# Altium schematic sheet XTXBoard(2CPU).SchDoc
size C; DocumentNumber: 6; SheetNumber: 6; SheetTotal: 8
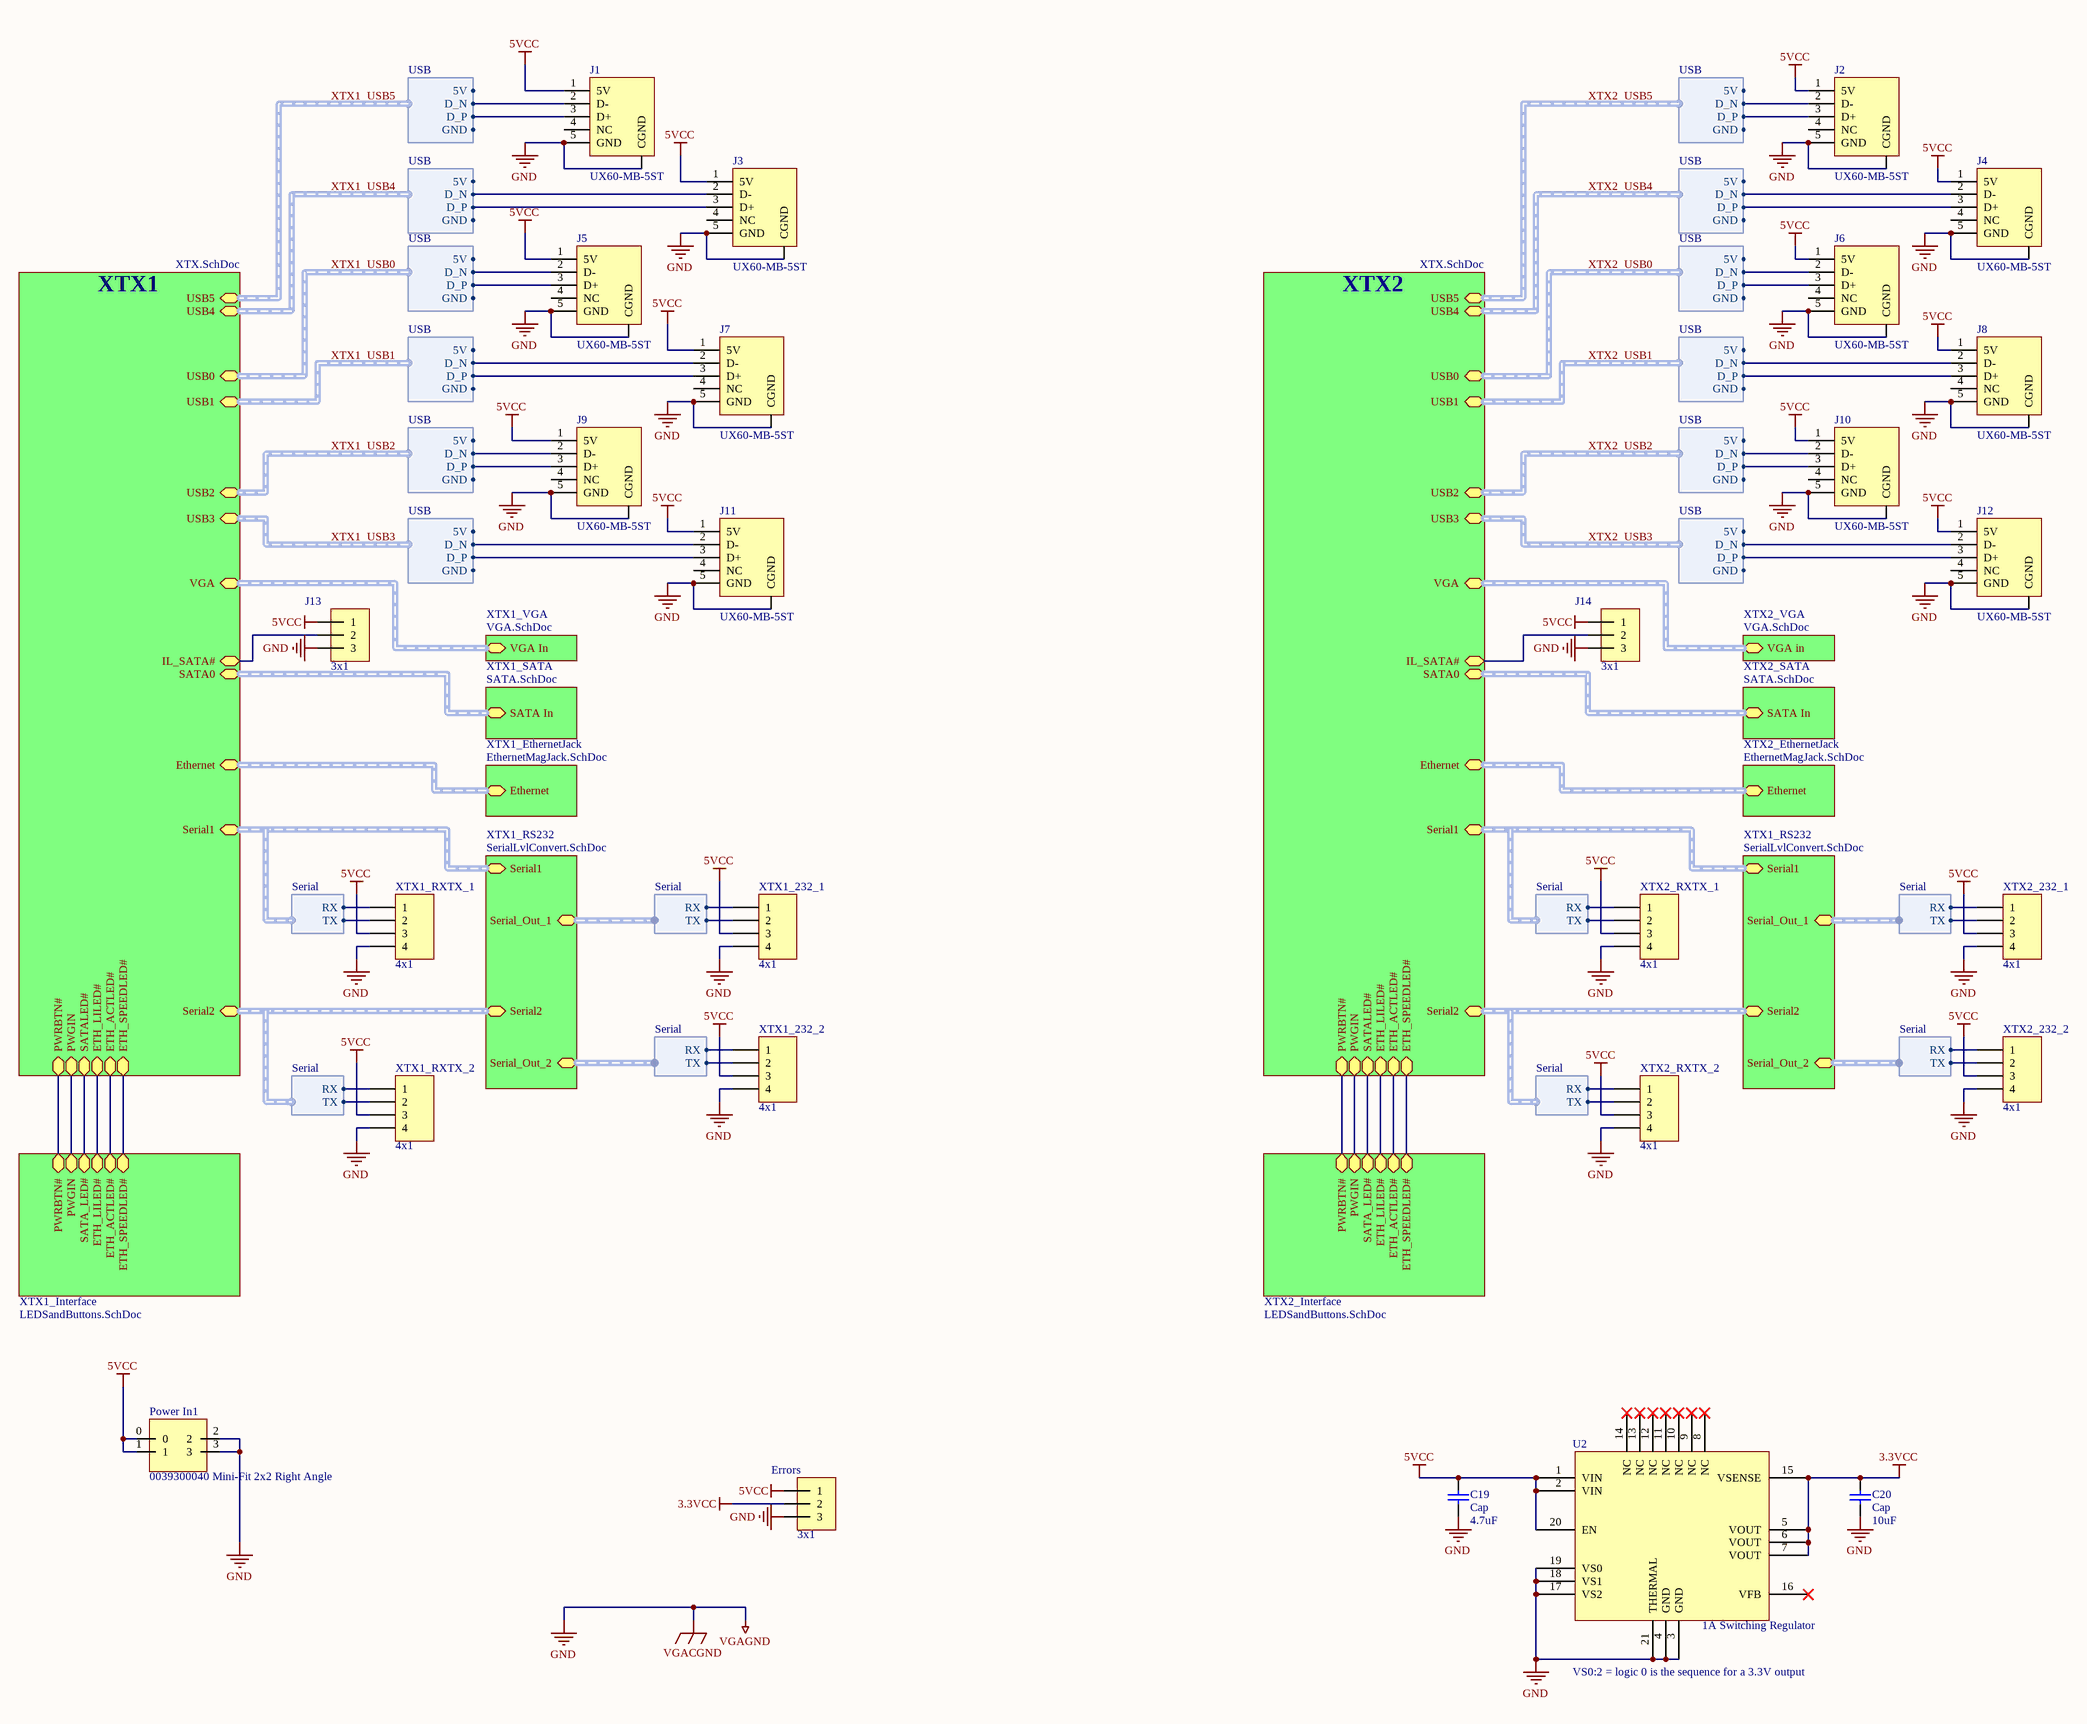
[diagram p0: XTXBoard(2CPU).SchDoc]

## Parts
C19  Cap  value 4.7uF  [0805 (2012) Capacitor]
C20  Cap  value 10uF  [1210 (3225) Capacitor]
Errors  3x1  [Male 3x1]
J1  UX60-MB-5ST  [UX60-MB-5ST]
J2  UX60-MB-5ST  [UX60-MB-5ST]
J3  UX60-MB-5ST  [UX60-MB-5ST]
J4  UX60-MB-5ST  [UX60-MB-5ST]
J5  UX60-MB-5ST  [UX60-MB-5ST]
J6  UX60-MB-5ST  [UX60-MB-5ST]
J7  UX60-MB-5ST  [UX60-MB-5ST]
J8  UX60-MB-5ST  [UX60-MB-5ST]
J9  UX60-MB-5ST  [UX60-MB-5ST]
J10  UX60-MB-5ST  [UX60-MB-5ST]
J11  UX60-MB-5ST  [UX60-MB-5ST]
J12  UX60-MB-5ST  [UX60-MB-5ST]
J13  3x1  [Male 3x1]
J14  3x1  [Male 3x1]
Power_In1  0039300040 Mini-Fit 2x2 Right Angle  [0039300040 MINI-FIT JR 4-Pos Right Angle]
U2  1A Switching Regulator  [QFN65P400X500X80-20N]
XTX1_232_1  4x1  [Male 4x1]
XTX1_232_2  4x1  [Male 4x1]
XTX1_RXTX_1  4x1  [Male 4x1]
XTX1_RXTX_2  4x1  [Male 4x1]
XTX2_232_1  4x1  [Male 4x1]
XTX2_232_2  4x1  [Male 4x1]
XTX2_RXTX_1  4x1  [Male 4x1]
XTX2_RXTX_2  4x1  [Male 4x1]

## Sub-sheets
XTX1 = XTX.SchDoc: ETH_LILED#, ETH_ACTLED#, ETH_SPEEDLED#, Ethernet (harness Ethernet), SATA0 (harness SATA), VGA (harness VGA), USB0 (harness USB), USB2 (harness USB), USB3 (harness USB), USB1 (harness USB), SATALED#, Serial1 (harness Serial), Serial2 (harness Serial), PWRBTN#, PWGIN, IL_SATA#, USB5 (harness USB), USB4 (harness USB)
XTX1_EthernetJack = EthernetMagJack.SchDoc: Ethernet (harness Ethernet)
XTX1_Interface = LEDSandButtons.SchDoc: ETH_LILED#, ETH_ACTLED#, SATA_LED#, PWRBTN#, ETH_SPEEDLED#, PWGIN
XTX1_RS232 = SerialLvlConvert.SchDoc: Serial1 (harness Serial), Serial2 (harness Serial), Serial_Out_1 (harness Serial), Serial_Out_2 (harness Serial)
XTX1_RS232 = SerialLvlConvert.SchDoc: Serial1 (harness Serial), Serial2 (harness Serial), Serial_Out_1 (harness Serial), Serial_Out_2 (harness Serial)
XTX1_SATA = SATA.SchDoc: SATA In (harness SATA)
XTX1_VGA = VGA.SchDoc: VGA In (harness VGA)
XTX2 = XTX.SchDoc: USB5 (harness USB), USB4 (harness USB), USB0 (harness USB), USB1 (harness USB), USB2 (harness USB), USB3 (harness USB), VGA (harness VGA), IL_SATA#, SATA0 (harness SATA), Ethernet (harness Ethernet), Serial1 (harness Serial), Serial2 (harness Serial), PWRBTN#, PWGIN, ETH_LILED#, SATALED#, ETH_ACTLED#, ETH_SPEEDLED#
XTX2_EthernetJack = EthernetMagJack.SchDoc: Ethernet (harness Ethernet)
XTX2_Interface = LEDSandButtons.SchDoc: PWRBTN#, PWGIN, SATA_LED#, ETH_LILED#, ETH_ACTLED#, ETH_SPEEDLED#
XTX2_SATA = SATA.SchDoc: SATA In (harness SATA)
XTX2_VGA = VGA.SchDoc: VGA in (harness VGA)

## Harnesses
USB: 5V, D_N, D_P, GND
Serial: RX, TX

## Nets
3.3VCC: C20.2 Errors.2 U2.5(VOUT) U2.6(VOUT) U2.7(VOUT) U2.15(VSENSE)
5VCC: C19.2 Errors.1 J1.1(5V) J2.1(5V) J3.1(5V) J4.1(5V) J5.1(5V) J6.1(5V) J7.1(5V) J8.1(5V) J9.1(5V) J10.1(5V) J11.1(5V) J12.1(5V) J13.1 J14.1 Power_In1.0 Power_In1.1 U2.1(VIN) U2.2(VIN) U2.20(EN) XTX1_232_1.3 XTX1_232_2.3 XTX1_RXTX_1.3 XTX1_RXTX_2.3 XTX2_232_1.3 XTX2_232_2.3 XTX2_RXTX_1.3 XTX2_RXTX_2.3
GND: C19.1 C20.1 Errors.3 J1.5(GND) J1.CGND J2.5(GND) J2.CGND J3.5(GND) J3.CGND J4.5(GND) J4.CGND J5.5(GND) J5.CGND J6.5(GND) J6.CGND J7.5(GND) J7.CGND J8.5(GND) J8.CGND J9.5(GND) J9.CGND J10.5(GND) J10.CGND J11.5(GND) J11.CGND J12.5(GND) J12.CGND J13.3 J14.3 Power_In1.2 Power_In1.3 U2.3(GND) U2.4(GND) U2.17(VS2) U2.18(VS1) U2.19(VS0) U2.21(THERMAL) XTX1_232_1.4 XTX1_232_2.4 XTX1_RXTX_1.4 XTX1_RXTX_2.4 XTX2_232_1.4 XTX2_232_2.4 XTX2_RXTX_1.4 XTX2_RXTX_2.4  [also labelled VGACGND, VGAGND]
XTX1_USB0.D_N: J5.2(D-) ; sheet XTX1/USB0.D_N
XTX1_USB0.D_P: J5.3(D+) ; sheet XTX1/USB0.D_P
XTX1_USB1.D_N: J7.2(D-) ; sheet XTX1/USB1.D_N
XTX1_USB1.D_P: J7.3(D+) ; sheet XTX1/USB1.D_P
XTX1_USB2.D_N: J9.2(D-) ; sheet XTX1/USB2.D_N
XTX1_USB2.D_P: J9.3(D+) ; sheet XTX1/USB2.D_P
XTX1_USB3.D_N: J11.2(D-) ; sheet XTX1/USB3.D_N
XTX1_USB3.D_P: J11.3(D+) ; sheet XTX1/USB3.D_P
XTX1_USB4.D_N: J3.2(D-) ; sheet XTX1/USB4.D_N
XTX1_USB4.D_P: J3.3(D+) ; sheet XTX1/USB4.D_P
XTX1_USB5.D_N: J1.2(D-) ; sheet XTX1/USB5.D_N
XTX1_USB5.D_P: J1.3(D+) ; sheet XTX1/USB5.D_P
XTX2_USB0.D_N: J6.2(D-) ; sheet XTX2/USB0.D_N
XTX2_USB0.D_P: J6.3(D+) ; sheet XTX2/USB0.D_P
XTX2_USB1.D_N: J8.2(D-) ; sheet XTX2/USB1.D_N
XTX2_USB1.D_P: J8.3(D+) ; sheet XTX2/USB1.D_P
XTX2_USB2.D_N: J10.2(D-) ; sheet XTX2/USB2.D_N
XTX2_USB2.D_P: J10.3(D+) ; sheet XTX2/USB2.D_P
XTX2_USB3.D_N: J12.2(D-) ; sheet XTX2/USB3.D_N
XTX2_USB3.D_P: J12.3(D+) ; sheet XTX2/USB3.D_P
XTX2_USB4.D_N: J4.2(D-) ; sheet XTX2/USB4.D_N
XTX2_USB4.D_P: J4.3(D+) ; sheet XTX2/USB4.D_P
XTX2_USB5.D_N: J2.2(D-) ; sheet XTX2/USB5.D_N
XTX2_USB5.D_P: J2.3(D+) ; sheet XTX2/USB5.D_P
NetJ13_2: J13.2 ; sheet XTX1/IL_SATA#
NetJ14_2: J14.2 ; sheet XTX2/IL_SATA#
NetXTX1_232_1_1: XTX1_232_1.1 ; sheet XTX1_RS232/Serial_Out_1.RX
NetXTX1_232_1_2: XTX1_232_1.2 ; sheet XTX1_RS232/Serial_Out_1.TX
NetXTX1_232_2_1: XTX1_232_2.1 ; sheet XTX1_RS232/Serial_Out_2.RX
NetXTX1_232_2_2: XTX1_232_2.2 ; sheet XTX1_RS232/Serial_Out_2.TX
NetXTX1_RXTX_1_1: XTX1_RXTX_1.1 ; sheet XTX1/Serial1.RX
NetXTX1_RXTX_1_2: XTX1_RXTX_1.2 ; sheet XTX1/Serial1.TX
NetXTX1_RXTX_2_1: XTX1_RXTX_2.1 ; sheet XTX1/Serial2.RX
NetXTX1_RXTX_2_2: XTX1_RXTX_2.2 ; sheet XTX1/Serial2.TX
NetXTX2_232_1_1: XTX2_232_1.1 ; sheet XTX1_RS232/Serial_Out_1.RX
NetXTX2_232_1_2: XTX2_232_1.2 ; sheet XTX1_RS232/Serial_Out_1.TX
NetXTX2_232_2_1: XTX2_232_2.1 ; sheet XTX1_RS232/Serial_Out_2.RX
NetXTX2_232_2_2: XTX2_232_2.2 ; sheet XTX1_RS232/Serial_Out_2.TX
NetXTX2_RXTX_1_1: XTX2_RXTX_1.1 ; sheet XTX2/Serial1.RX
NetXTX2_RXTX_1_2: XTX2_RXTX_1.2 ; sheet XTX2/Serial1.TX
NetXTX2_RXTX_2_1: XTX2_RXTX_2.1 ; sheet XTX2/Serial2.RX
NetXTX2_RXTX_2_2: XTX2_RXTX_2.2 ; sheet XTX2/Serial2.TX
(unnamed): sheet XTX1/ETH_LILED#, sheet XTX1_Interface/ETH_LILED#
(unnamed): sheet XTX1/ETH_ACTLED#, sheet XTX1_Interface/ETH_ACTLED#
(unnamed): sheet XTX1/ETH_SPEEDLED#, sheet XTX1_Interface/ETH_SPEEDLED#
(unnamed): sheet XTX1/SATALED#, sheet XTX1_Interface/SATA_LED#
(unnamed): sheet XTX1/PWRBTN#, sheet XTX1_Interface/PWRBTN#
(unnamed): sheet XTX1/PWGIN, sheet XTX1_Interface/PWGIN
(unnamed): sheet XTX2/PWRBTN#, sheet XTX2_Interface/PWRBTN#
(unnamed): sheet XTX2/PWGIN, sheet XTX2_Interface/PWGIN
(unnamed): sheet XTX2/ETH_LILED#, sheet XTX2_Interface/ETH_LILED#
(unnamed): sheet XTX2/SATALED#, sheet XTX2_Interface/SATA_LED#
(unnamed): sheet XTX2/ETH_ACTLED#, sheet XTX2_Interface/ETH_ACTLED#
(unnamed): sheet XTX2/ETH_SPEEDLED#, sheet XTX2_Interface/ETH_SPEEDLED#

Not connected (* = marked no-connect by the designer): J1 4(NC); J2 4(NC); J3 4(NC); J4 4(NC); J5 4(NC); J6 4(NC); J7 4(NC); J8 4(NC); J9 4(NC); J10 4(NC); J11 4(NC); J12 4(NC); U2 8(NC)* 9(NC)* 10(NC)* 11(NC)* 12(NC)* 13(NC)* 14(NC)* 16(VFB)*

## Buses and harness runs
harness sheet XTX1/Ethernet = sheet XTX1_EthernetJack/Ethernet
harness sheet XTX1/SATA0 = sheet XTX1_SATA/SATA In
harness sheet XTX1/Serial1 = sheet XTX1_RS232/Serial1
harness sheet XTX1/Serial2 = sheet XTX1_RS232/Serial2
harness sheet XTX1/VGA = sheet XTX1_VGA/VGA In
harness sheet XTX1_RS232/Serial1 = sheet XTX2/Serial1
harness sheet XTX1_RS232/Serial2 = sheet XTX2/Serial2
harness sheet XTX2/Ethernet = sheet XTX2_EthernetJack/Ethernet
harness sheet XTX2/SATA0 = sheet XTX2_SATA/SATA In
harness sheet XTX2/VGA = sheet XTX2_VGA/VGA in
harness XTX1_USB0 = sheet XTX1/USB0
harness XTX1_USB1 = sheet XTX1/USB1
harness XTX1_USB2 = sheet XTX1/USB2
harness XTX1_USB3 = sheet XTX1/USB3
harness XTX1_USB4 = sheet XTX1/USB4
harness XTX1_USB5 = sheet XTX1/USB5
harness XTX2_USB0 = sheet XTX2/USB0
harness XTX2_USB1 = sheet XTX2/USB1
harness XTX2_USB2 = sheet XTX2/USB2
harness XTX2_USB3 = sheet XTX2/USB3
harness XTX2_USB4 = sheet XTX2/USB4
harness XTX2_USB5 = sheet XTX2/USB5

## Notes on the sheet
- (near U2) VS0:2 = logic 0 is the sequence for a 3.3V output

## Library data of the parts
C19 C20 = Cap: Capacitor; Published: 8-Jun-2000; LatestRevisionDate: 17-Jul-2002; LatestRevisionNote: Re-released for DXP Platform.; PackageReference: RAD-0.3; Publisher: Altium Limited; Supplier: Digi-Key
  C19: Supplier Part Number: 490-3901-1-ND
  C20: Supplier Part Number: 445-1401-1-ND
Errors J13 J14 = 3x1: 3x1 100mil Header; Supplier Part Number: 929400E-01-36-ND; Supplier: Digi-Key
J1-J12 = UX60-MB-5ST: miniUSB Type B SMT Connector; Supplier Part Number: H2959CT-ND; Supplier: Digi-Key
U2 = Component_1: 1A Step Down Voltage Converter; Manufacturer 1: Enpirion; Manufacturer 1 Part Number: EN5311QI; Supplier: Mouser; Supplier Part Number: 884-EN5311QI
XTX1_232_1 XTX1_232_2 XTX1_RXTX_1 XTX1_RXTX_2 XTX2_232_1 XTX2_232_2 XTX2_RXTX_1 XTX2_RXTX_2 = Header 4: Header, 4-Pin; LatestRevisionDate: 17-Jul-2002; LatestRevisionNote: Re-released for DXP Platform.; Publisher: Altium Limited; Supplier Part Number: 929400E-01-36-ND; Supplier: Digi-Key
Power_In1 = 0039300040 Mini-Fit 2x2 Right Angle: Supplier Part Number: WM21352-ND; Supplier: Digi-Key